# Altium project Smart Dimmer.PrjPcb
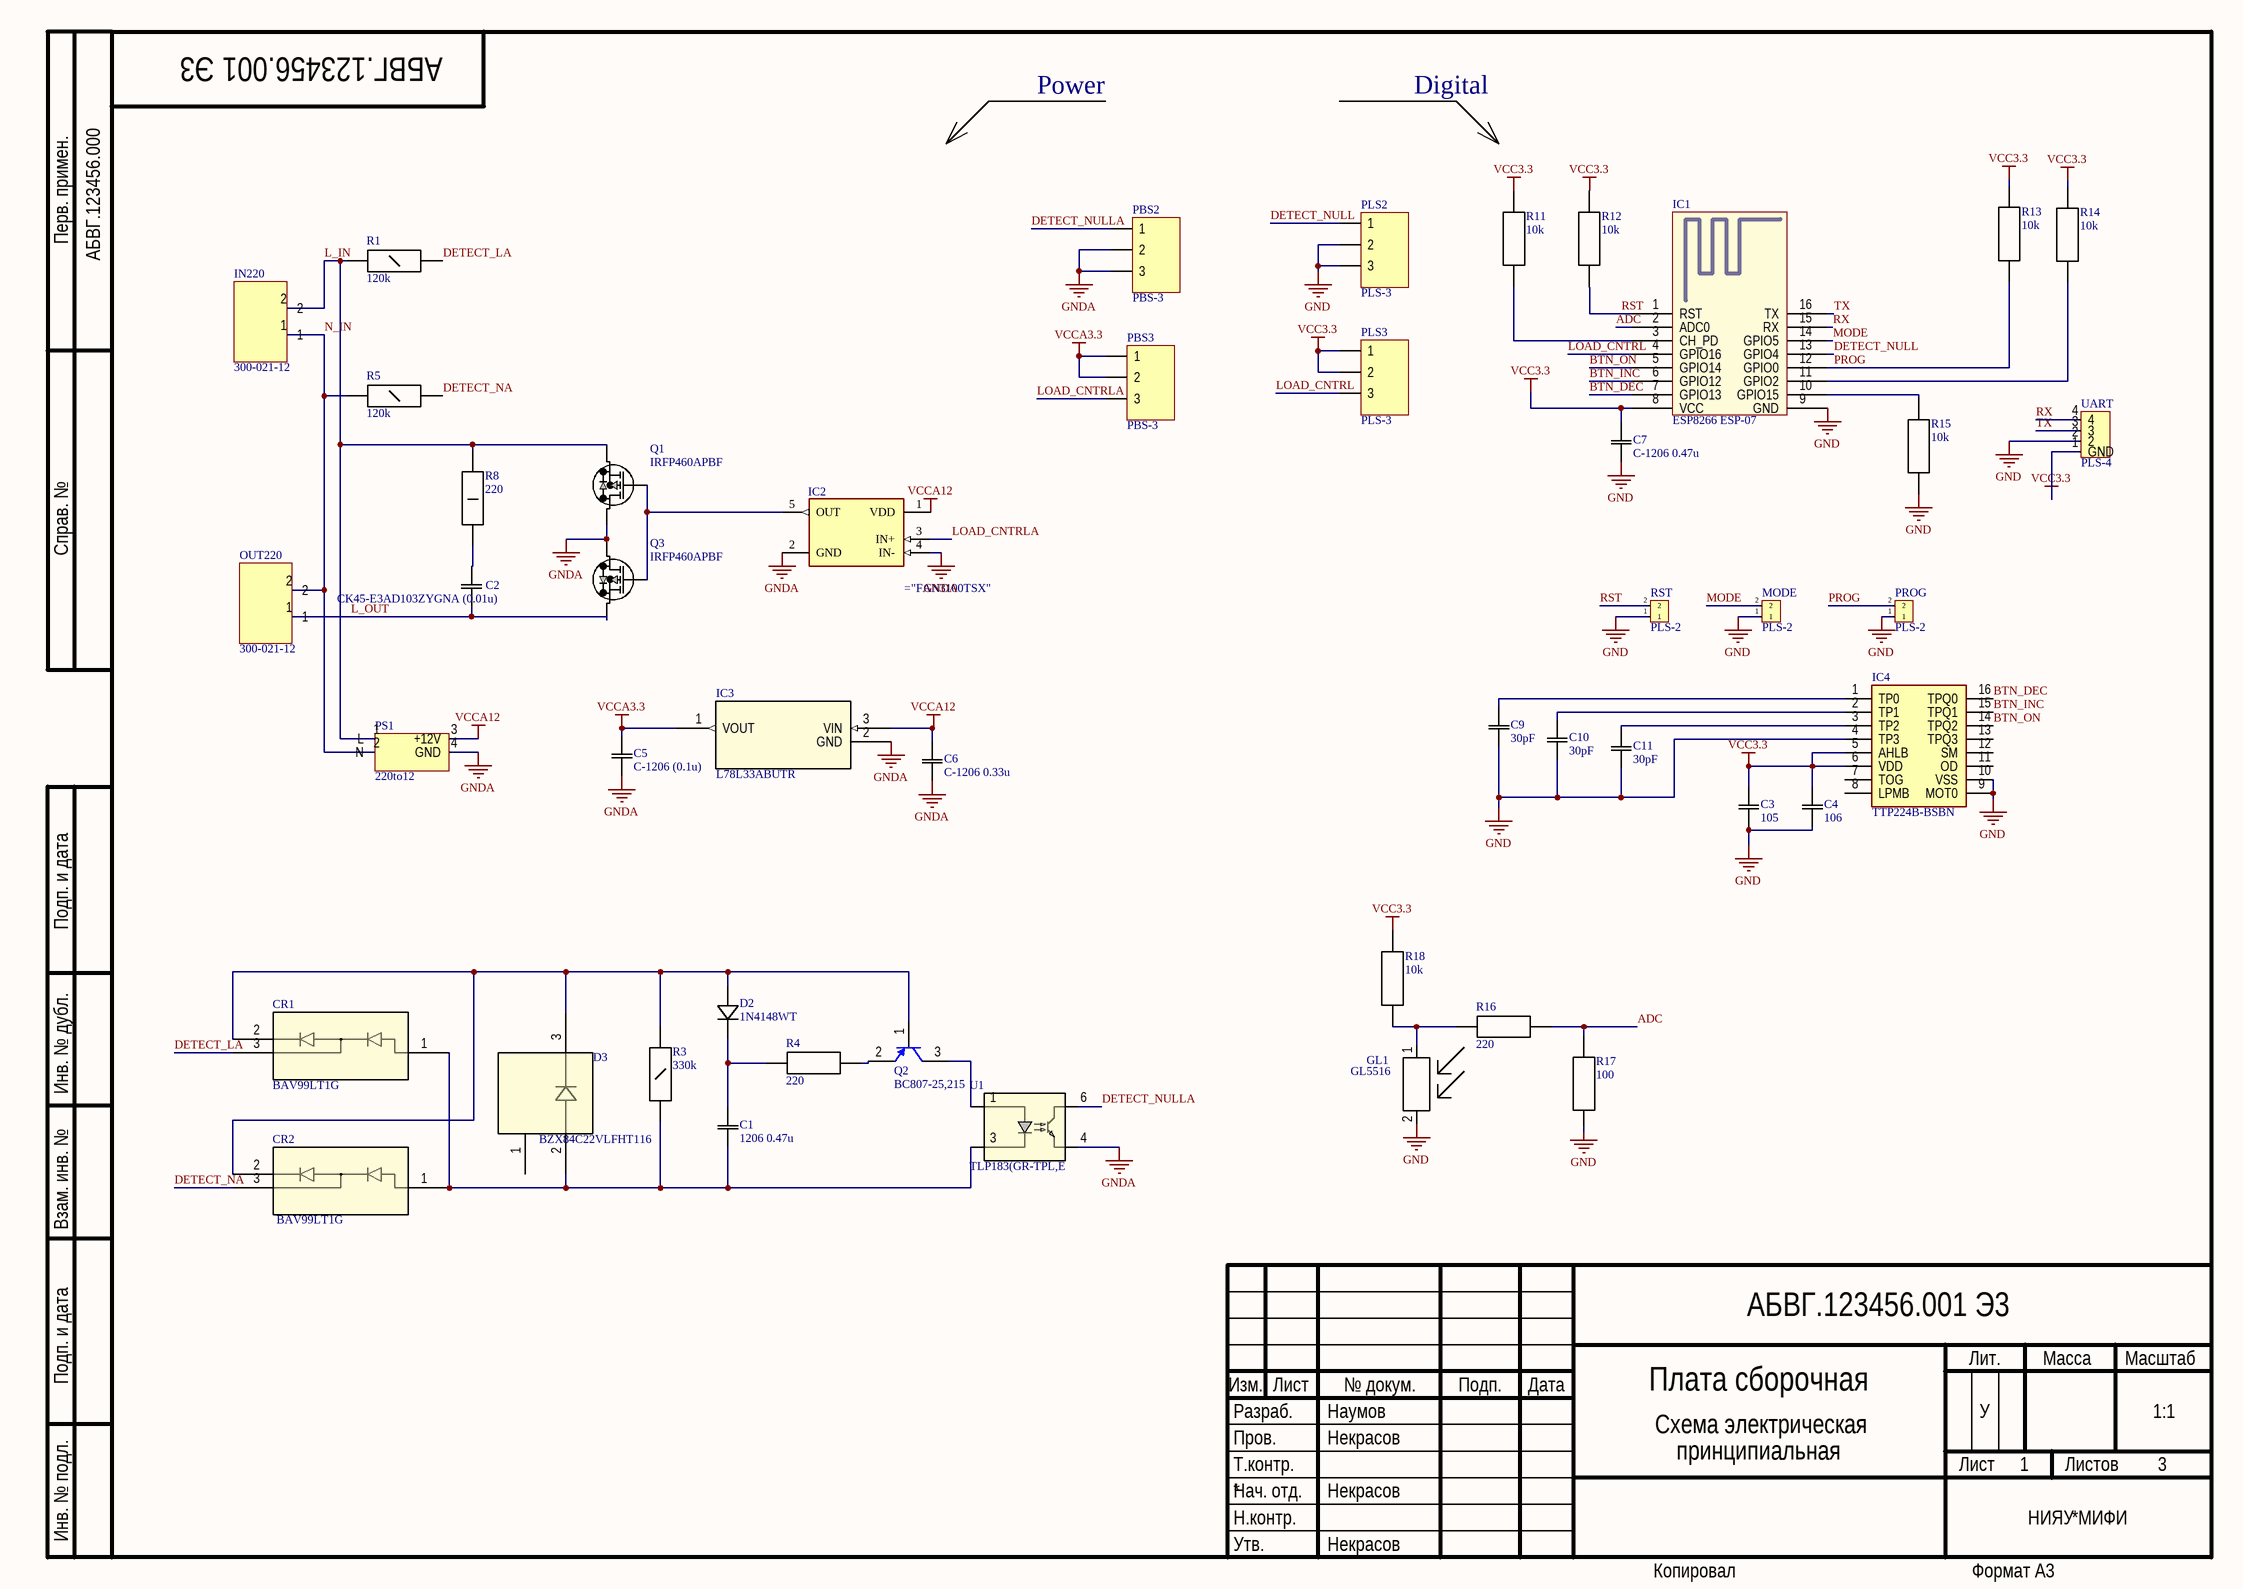
[diagram p0: dimmer.SchDoc]
3 sheets, 94 parts. Net scope: global (net labels, ports and power ports of the same name join across sheets).
Board files: PCB12_sensor.PcbDoc, PCB9.PcbDoc, PCB5.PcbDoc, PCB11_sensor.PcbDoc
Sheets:
  dimmer.SchDoc
  power.SchDoc
  digital.SchDoc

## Sheet dimmer.SchDoc
size 420 x 297 mm; SheetNumber: 1; SheetTotal: 3; Scale: 1:1; Разраб.: Наумов; Обозначение документа: АБВГ.123456.001 Э3; Пров.: Некрасов; Утв.: Некрасов; Номер листа: 1; Общее количество листов: 3; Масштаб: 1:1; Литера: У; Наименование организации: НИЯУ МИФИ; Перв. применение: АБВГ.123456.000; Наименование изделия 1: Плата сборочная; Наименование изделия 2: Схема электрическая; Наименование изделия 3: принципиальная; Нач. отд.: Нач. отд.; Фамилия нач. отд.: Некрасов

### Parts
(Parts that share a designator on the sheet are numbered #1, #2 ... from top to bottom, then left to right.)
C1#1  1206 0.47u  [CAP_X7R_1206_AVX]
C2#1  CK45-E3AD103ZYGNA (0.01u)  [CAP_CK45E3103_TDK]
C3#1  105  [G-21_MUR]
C4#1  106  [G-21_MUR]
C5#1  C-1206 (0.1u)  [CAP_X7R_1206_AVX]
C6#1  C-1206 0.33u  [CAP_X7R_1206_AVX]
C7#1  C-1206 0.47u  [CAP_X7R_1206_AVX]
C9#1  30pF  [G-21_MUR]
C10#1  30pF  [G-21_MUR]
C11#1  30pF  [G-21_MUR]
CR1#1  BAV99LT1G  [SOT-23_TO-236_318-08_ONS]
CR2#1  BAV99LT1G  [SOT-23_TO-236_318-08_ONS]
D2#1  1N4148WT  [CR_SOD-523F_ONS]
D3#1  BZX84C22VLFHT116  [TRANS_BZX84_ROM]
GL1#1  GL5516  [GL5516]
IC1#1  ESP8266 ESP-07  [ESP8266 ESP-07]
IC2#1  FAN3100TSX  [ON_Semi_527AH_0]  (value not drawn)
IC3#1  L78L33ABUTR  [SOT-89_STM]
IC4#1  TTP224B-BSBN  [SOP64P600X175-16N]
IN220#1  300-021-12  [300-021-12]
MODE#1  PLS-2  [PLS-2]
OUT220#1  300-021-12  [300-021-12]
PBS2#1  PBS-3  [PBS-3]
PBS3#1  PBS-3  [PBS-3]
PLS2#1  PLS-3  [PLS-3]
PLS3#1  PLS-3  [PLS-3]
PROG#1  PLS-2  [PLS-2]
PS1#1  220to12  [220to12]
Q1#1  IRFP460APBF  [TO-247AC_VIS]
Q2  BC807-25,215  [SOT23_BC807_NEX]
Q3#1  IRFP460APBF  [TO-247AC_VIS]
R1#1  120k  [CAP_X7R_1206_AVX]
R3#1  330k  [CAP_X7R_1206_AVX]
R4#1  220  [G-21_MUR]
R5#1  120k  [CAP_X7R_1206_AVX]
R8#1  220  [RES2512_TL_TYCO_TYC]
R11#1  10k  [G-21_MUR]
R12#1  10k  [G-21_MUR]
R13#1  10k  [G-21_MUR]
R14#1  10k  [G-21_MUR]
R15#1  10k  [G-21_MUR]
R16#1  220  [G-21_MUR]
R17#1  100  [G-21_MUR]
R18#1  10k  [G-21_MUR]
RST#1  PLS-2  [PLS-2]
U1#1  TLP183(GR-TPL,E  [4pin SO6_TOS]
UART#1  PLS-4  [PLS-4]

### Nets
GND: C3#1.1 C4#1.1 C7#1.1 C9#1.1 C10#1.1 C11#1.1 GL1#1.2 IC1#1.9(GND) IC4#1.4(TP3) IC4#1.9(MOT0) IC4#1.10(VSS) MODE#1.1 PLS2#1.2 PLS2#1.3 PROG#1.1 R15#1.1 R17#1.1 RST#1.1 UART#1.2
GNDA: C5#1.1 C6#1.1 IC2#1.2(GND) IC2#1.4(IN-) IC3#1.2(GND) PBS2#1.2 PBS2#1.3 PS1#1.4(GND) Q1#1.2(D) Q3#1.2(D) U1#1.4
VCC3.3: C3#1.2 C4#1.2 C7#1.2 IC1#1.8(VCC) IC4#1.5(AHLB) IC4#1.6(VDD) PLS3#1.1 PLS3#1.2 R11#1.2 R12#1.2 R13#1.2 R14#1.2 R18#1.2 UART#1.1(GND)
VCCA3.3: C5#1.2 IC3#1.1(VOUT) PBS3#1.1 PBS3#1.2
VCCA12: C6#1.2 IC2#1.1(VDD) IC3#1.3(VIN) PS1#1.3(+12V)
ADC: IC1#1.2(ADC0) R16#1.1 R17#1.2
BTN_DEC: IC1#1.7(GPIO13) IC4#1.16(TPQ0)
BTN_INC: IC1#1.6(GPIO12) IC4#1.15(TPQ1)
BTN_ON: IC1#1.5(GPIO14) IC4#1.14(TPQ2)
DETECT_LA: CR1#1.3 R1#1.2
DETECT_NA: CR2#1.3 R5#1.2
DETECT_NULL: IC1#1.13(GPIO4) PLS2#1.1
DETECT_NULLA: PBS2#1.1 U1#1.6
L_IN: IN220#1.2 PS1#1.1(L) Q1#1.3(S) R1#1.1 R8#1.2
L_OUT: C2#1.1 OUT220#1.1 Q3#1.3(S)
LOAD_CNTRL: IC1#1.4(GPIO16) PLS3#1.3
LOAD_CNTRLA: IC2#1.3(IN+) PBS3#1.3
MODE: IC1#1.14(GPIO5) MODE#1.2
N_IN: IN220#1.1 OUT220#1.2 PS1#1.2(N) R5#1.1
PROG: IC1#1.12(GPIO0) PROG#1.2 R13#1.1
RST: IC1#1.1(RST) R12#1.1 RST#1.2
RX: IC1#1.15(RX) UART#1.4
TX: IC1#1.16(TX) UART#1.3
NetC1#1_1: C1#1.1 CR1#1.1 CR2#1.1 D3#1.2 R3#1.1 U1#1.3
NetC1#1_2: C1#1.2 D2#1.1 R4#1.1
NetC2#1_2: C2#1.2 R8#1.1
NetC9#1_2: C9#1.2 IC4#1.1(TP0)
NetC10#1_2: C10#1.2 IC4#1.2(TP1)
NetC11#1_2: C11#1.2 IC4#1.3(TP2)
NetCR1#1_2: CR1#1.2 CR2#1.2 D2#1.2 D3#1.3 Q2.1(B) R3#1.2
NetGL1#1_1: GL1#1.1 R16#1.2 R18#1.1
NetIC1#1_3: IC1#1.3(CH_PD) R11#1.1
NetIC1#1_10: IC1#1.10(GPIO15) R15#1.2
NetIC1#1_11: IC1#1.11(GPIO2) R14#1.1
NetIC2#1_5: IC2#1.5(OUT) Q1#1.1(G) Q3#1.1(G)
NetQ2_2: Q2.2 R4#1.2
NetQ2_3: Q2.3(C) U1#1.1

Not connected (* = marked no-connect by the designer): D3#1 1(2); IC4#1 7(TOG) 8(LPMB) 11(OD) 12(SM) 13(TPQ3)

### Notes on the sheet
- Power
- Digital
- Перв. примен.
- Справ. №
- Подп. и дата
- Инв. № дубл.
- Взам. инв. №
- Разраб.
- Изм.
- Лист
- № докум.
- Подп.
- Дата
- Лит.
- Масса
- Масштаб
- Пров.
- Т.контр.
- Листов
- Инв. № подл.
- Утв.
- Н.контр.
- Копировал
- Формат А3

### Library data of the parts
C1#1 C5#1 C6#1 C7#1 = C-1206: No Description Available; Manufacturer_Part_Number: 12061C104KAT2A; Vendor: AVX Corporation; Built_By: EMA_UL_Team; SourceLibrary: AVX_2012-08-08; Type: DEV; Copyright: Copyright (C) 2018 Accelerated Designs. All rights reserved; RefDes: RefDes
C2#1 = CK45-E3AD103ZYGNA: No Description Available; Built_By: EMA_Matt; Vendor: TDK; SourceLibrary: TDK_2019-10-09; Type: DEV; Copyright: Copyright (C) 2018 Accelerated Designs. All rights reserved; Manufacturer_Part_Number: CK45-E3AD103ZYGNA; RefDes: RefDes
C3#1 C4#1 C9#1 C10#1 C11#1 = cap0805: Manufacturer_Part_Number: GRM21BR71H224KA01L; Vendor: Murata; SourceLibrary: Murata_2014-12-31; Type: DEV; Copyright: Copyright (C) 2015 Accelerated Designs. All rights reserved; RefDes: RefDes
CR1#1 CR2#1 = BAV99LT1G: No Description Available; Vendor: ON Semiconductor; Built_By: EMA_Cory; SourceLibrary: ON_Semiconductor_2020-05-27; Type: DEV; Datasheet: https://www.onsemi.com/pub/Collateral/BAV99LT1-D.PDF; Manufacturer_Part_Number: BAV99LT1G; Copyright: Copyright (C) 2018 Accelerated Designs. All rights reserved; RefDes: RefDes
D2#1 = 1N4148WT: No Description Available; Vendor: ON Semiconductor; Built_By: EMA_Cory; SourceLibrary: ON_Semiconductor_2020-03-23; Type: DEV; Datasheet: https://www.onsemi.com/pub/Collateral/1N914BWT-D.pdf; Manufacturer_Part_Number: 1N4148WT; Copyright: Copyright (C) 2018 Accelerated Designs. All rights reserved; RefDes: RefDes
D3#1 = BZX84C22VLFHT116: No Description Available; Vendor: ROHM Semiconductor; Built_By: EMA_Matt; SourceLibrary: Rohm_2019-09-23; Type: DEV; Manufacturer_Part_Number: BZX84C22VLFHT116; Copyright: Copyright (C) 2018 Accelerated Designs. All rights reserved; RefDes: RefDes
IC3#1 = L78L33ABUTR: No Description Available; SourceLibrary: StMicro_2011-06-07; Built_By: EMA_UL_Team; Vendor: STMicroelectronics; Manufacturer_Part_Number: L78L33ABUTR; Copyright: Copyright (C) 2018 Accelerated Designs. All rights reserved; RefDes: RefDes; Type: DEV
IC4#1 = TTP224B-BSBN: Integrated Circuit; Manufacturer_Name: TONTEK; Datasheet Link: https://datasheet.lcsc.com/szlcsc/Tontek-Design-Tech-TTP224B-BSBN_C94149.pdf; Height: 1.75mm; Manufacturer_Part_Number: TTP224B-BSBN
Q1#1 Q3#1 = IRFP460APBF: No Description Available; Vendor: Vishay; Built_By: EMA_UL_Team; SourceLibrary: Vishay_2020-02-10; Type: DEV; Manufacturer_Part_Number: IRFP460APBF; Copyright: Copyright (C) 2018 Accelerated Designs. All rights reserved; RefDes: RefDes
Q2 = BC807-25,215: No Description Available; Built_By: EMA_Justin; Vendor: Nexperia; SourceLibrary: Nexperia_2018-12-15; Type: DEV; Copyright: Copyright (C) 2016 Accelerated Designs. All rights reserved; Manufacturer_Part_Number: BC807-25,215; RefDes: RefDes
R1#1 R3#1 R5#1 = R-1206
R4#1 R11#1 R12#1 R13#1 R14#1 R15#1 R16#1 R17#1 R18#1 = res0805: Resistor 0805
R8#1 = R-2512: No Description Available; Manufacturer_Part_Number: TL3AR033F; Vendor: TE Connectivity; Built_By: EMA_UL_Team; SourceLibrary: Tyco_2012-01-31a; Copyright: Copyright (C) 2018 Accelerated Designs. All rights reserved; RefDes: RefDes; Type: DEV
U1#1 = TLP183(GR-TPL,E: No Description Available; Vendor: Toshiba; Built_By: EMA_UL_Team; SourceLibrary: Toshiba_2019-12-10; Number_devices_in_Package: 1; Manufacturer_Part_Number: TLP183(GR-TPL,E; Copyright: Copyright (C) 2018 Accelerated Designs. All rights reserved; RefDes: RefDes; Type: DEV; Source_Package: TLP183

## Sheet power.SchDoc
size 209 x 297 mm; Scale: 1:1; Обозначение документа: АБВГ.123456.001 Э3; Номер листа: 2; Разраб.: Наумов; Пров.: Некрасов; Утв.: Некрасов; Масштаб: 1:1; Литера: У; Наименование организации: НИЯУ МИФИ; Перв. применение: АБВГ.123456.000; Наименование изделия 1: Плата силовая; Наименование изделия 2: Схема электрическая; Наименование изделия 3: принципиальная; Нач. отд.: Нач. отд.
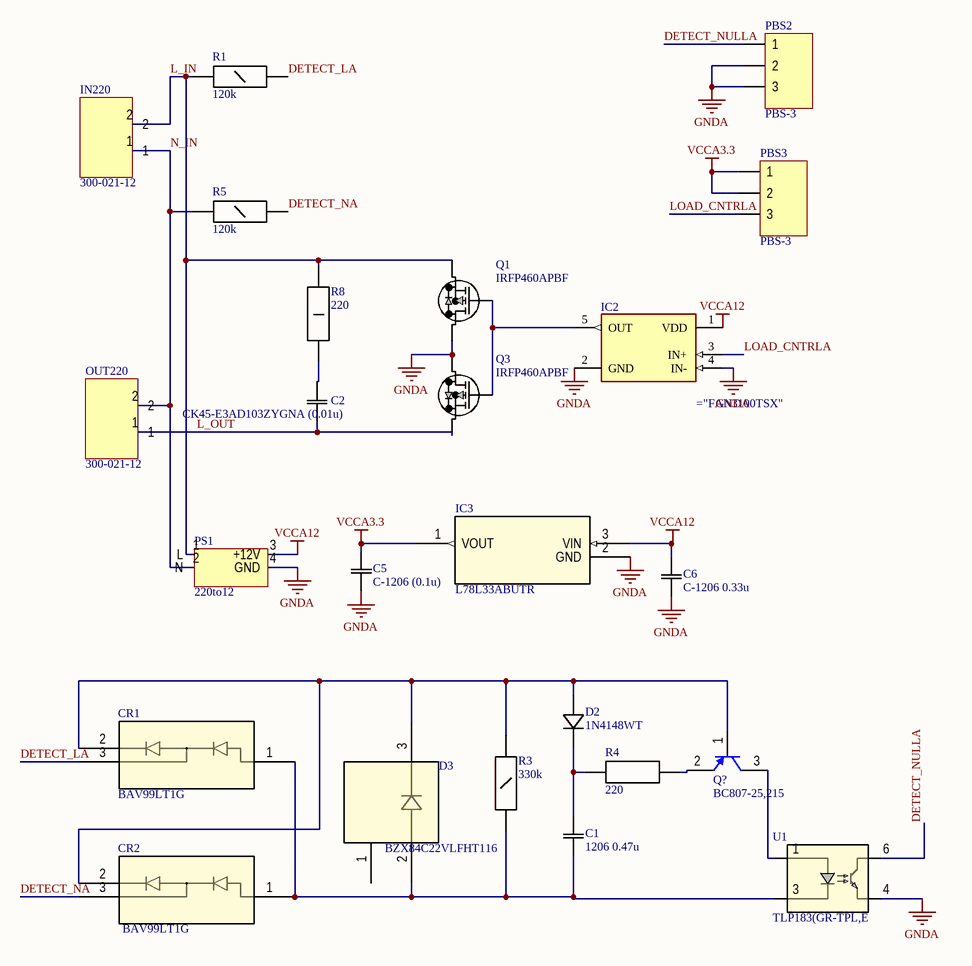
[diagram p1: power.SchDoc]

### Parts
(Parts that share a designator on the sheet are numbered #1, #2 ... from top to bottom, then left to right.)
C1#2  1206 0.47u  [CAP_X7R_1206_AVX]
C2#2  CK45-E3AD103ZYGNA (0.01u)  [CAP_CK45E3103_TDK]
C5#2  C-1206 (0.1u)  [CAP_X7R_1206_AVX]
C6#2  C-1206 0.33u  [CAP_X7R_1206_AVX]
CR1#2  BAV99LT1G  [SOT-23_TO-236_318-08_ONS]
CR2#2  BAV99LT1G  [SOT-23_TO-236_318-08_ONS]
D2#2  1N4148WT  [CR_SOD-523F_ONS]
D3#2  BZX84C22VLFHT116  [TRANS_BZX84_ROM]
IC2#2  FAN3100TSX  [ON_Semi_527AH_0]  (value not drawn)
IC3#2  L78L33ABUTR  [SOT-89_STM]
IN220#2  300-021-12  [300-021-12]
OUT220#2  300-021-12  [300-021-12]
PBS2#2  PBS-3  [PBS-3]
PBS3#2  PBS-3  [PBS-3]
PS1#2  220to12  [220to12]
Q1#2  IRFP460APBF  [TO-247AC_VIS]
Q3#2  IRFP460APBF  [TO-247AC_VIS]
Q?  BC807-25,215  [SOT23_BC807_NEX]
R1#2  120k  [CAP_X7R_1206_AVX]
R3#2  330k  [CAP_X7R_1206_AVX]
R4#2  220  [G-21_MUR]
R5#2  120k  [CAP_X7R_1206_AVX]
R8#2  220  [RES2512_TL_TYCO_TYC]
U1#2  TLP183(GR-TPL,E  [4pin SO6_TOS]

### Nets
GNDA: C5#2.1 C6#2.1 IC2#2.2(GND) IC2#2.4(IN-) IC3#2.2(GND) PBS2#2.2 PBS2#2.3 PS1#2.4(GND) Q1#2.2(D) Q3#2.2(D) U1#2.4
VCCA3.3: C5#2.2 IC3#2.1(VOUT) PBS3#2.1 PBS3#2.2
VCCA12: C6#2.2 IC2#2.1(VDD) IC3#2.3(VIN) PS1#2.3(+12V)
DETECT_LA: CR1#2.3 R1#2.2
DETECT_NA: CR2#2.3 R5#2.2
DETECT_NULLA: PBS2#2.1 U1#2.6
L_IN: IN220#2.2 PS1#2.1(L) Q1#2.3(S) R1#2.1 R8#2.2
L_OUT: C2#2.1 OUT220#2.1 Q3#2.3(S)
LOAD_CNTRLA: IC2#2.3(IN+) PBS3#2.3
N_IN: IN220#2.1 OUT220#2.2 PS1#2.2(N) R5#2.1
NetC1#2_1: C1#2.1 CR1#2.1 CR2#2.1 D3#2.2 R3#2.1 U1#2.3
NetC1#2_2: C1#2.2 D2#2.1 R4#2.1
NetC2#2_2: C2#2.2 R8#2.1
NetCR1#2_2: CR1#2.2 CR2#2.2 D2#2.2 D3#2.3 Q?.1(B) R3#2.2
NetIC2#2_5: IC2#2.5(OUT) Q1#2.1(G) Q3#2.1(G)
NetQ?_2: Q?.2 R4#2.2
NetQ?_3: Q?.3(C) U1#2.1

Not connected (* = marked no-connect by the designer): D3#2 1(2)

### Notes on the sheet
- Перв. примен.
- Справ. №
- Подп. и дата
- Инв. № дубл.
- Взам. инв. №
- Разраб.
- Изм.
- Лист
- № докум.
- Подп.
- Дата
- Лит.
- Масса
- Масштаб
- Пров.
- Т.контр.
- Листов
- Инв. № подл.
- Утв.
- Н.контр.
- Копировал
- Формат А4

### Library data of the parts
C1#2 C5#2 C6#2 = C-1206: as C1#1 on sheet dimmer; Copyright: Copyright (C) 2018 Accelerated Designs. All rights reserved; RefDes: RefDes
C2#2 = CK45-E3AD103ZYGNA: as C2#1 on sheet dimmer; Copyright: Copyright (C) 2018 Accelerated Designs. All rights reserved; Manufacturer_Part_Number: CK45-E3AD103ZYGNA; RefDes: RefDes
CR1#2 CR2#2 = BAV99LT1G: as CR1#1 on sheet dimmer; Datasheet: https://www.onsemi.com/pub/Collateral/BAV99LT1-D.PDF; Manufacturer_Part_Number: BAV99LT1G; Copyright: Copyright (C) 2018 Accelerated Designs. All rights reserved; RefDes: RefDes
D2#2 = 1N4148WT: as D2#1 on sheet dimmer; Datasheet: https://www.onsemi.com/pub/Collateral/1N914BWT-D.pdf; Manufacturer_Part_Number: 1N4148WT; Copyright: Copyright (C) 2018 Accelerated Designs. All rights reserved; RefDes: RefDes
D3#2 = BZX84C22VLFHT116: as D3#1 on sheet dimmer; Manufacturer_Part_Number: BZX84C22VLFHT116; Copyright: Copyright (C) 2018 Accelerated Designs. All rights reserved; RefDes: RefDes
IC3#2 = L78L33ABUTR: as IC3#1 on sheet dimmer; Manufacturer_Part_Number: L78L33ABUTR; Copyright: Copyright (C) 2018 Accelerated Designs. All rights reserved; RefDes: RefDes; Type: DEV
Q1#2 Q3#2 = IRFP460APBF: as Q1#1 on sheet dimmer; Manufacturer_Part_Number: IRFP460APBF; Copyright: Copyright (C) 2018 Accelerated Designs. All rights reserved; RefDes: RefDes
Q? = BC807-25,215: as Q2 on sheet dimmer; Copyright: Copyright (C) 2016 Accelerated Designs. All rights reserved; Manufacturer_Part_Number: BC807-25,215; RefDes: RefDes
R1#2 R3#2 R5#2 = R-1206
R4#2 = res0805: Resistor 0805
R8#2 = R-2512: as R8#1 on sheet dimmer; Copyright: Copyright (C) 2018 Accelerated Designs. All rights reserved; RefDes: RefDes; Type: DEV
U1#2 = TLP183(GR-TPL,E: as U1#1 on sheet dimmer; Manufacturer_Part_Number: TLP183(GR-TPL,E; Copyright: Copyright (C) 2018 Accelerated Designs. All rights reserved; RefDes: RefDes; Type: DEV; Source_Package: TLP183

## Sheet digital.SchDoc
size 209 x 297 mm; Scale: 1:1; Разраб.: Наумов; Обозначение документа: АБВГ.123456.001 Э3; Пров.: Некрасов; Утв.: Некрасов; Номер листа: 3; Общее количество листов: 3; Масштаб: 1:1; Литера: У; Наименование организации: НИЯУ МИФИ; Перв. применение: АБВГ.123456.000; Наименование изделия 1: Плата цифровая; Наименование изделия 2: Схема электрическая; Наименование изделия 3: принципиальная; Нач. отд.: Нач. отд.
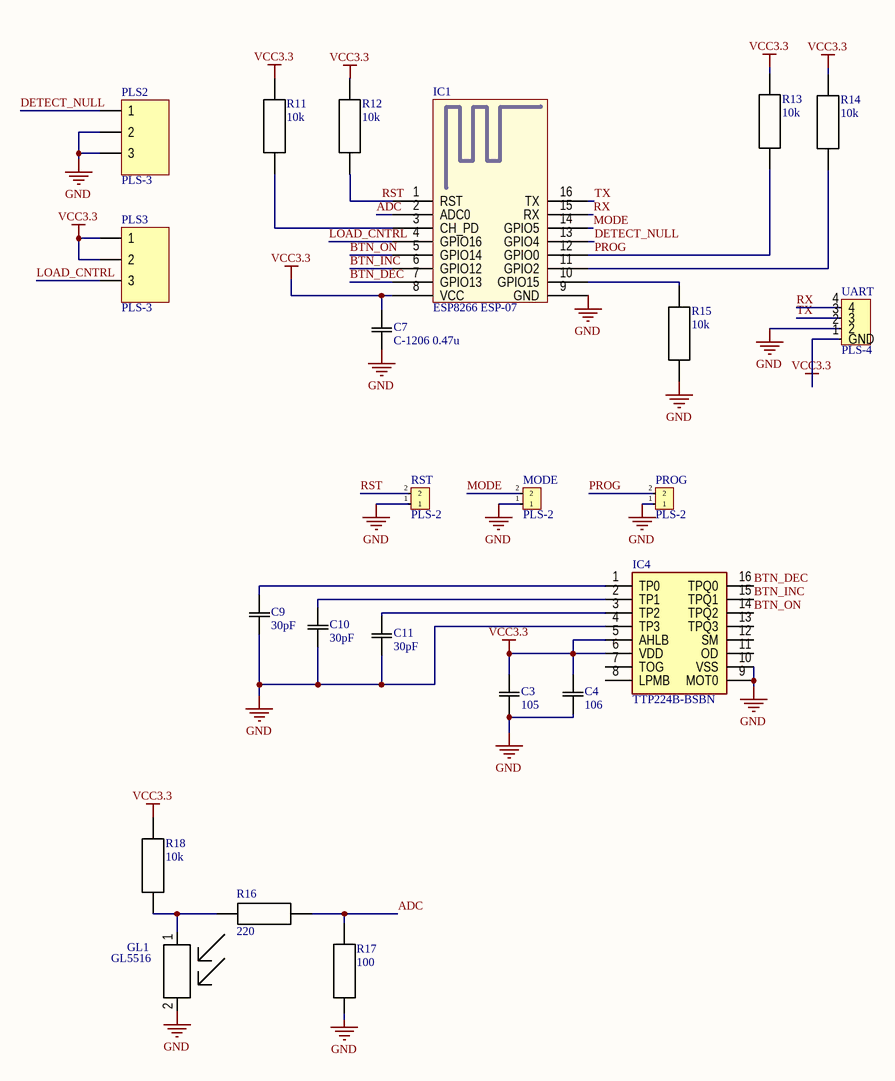
[diagram p2: digital.SchDoc]

### Parts
(Parts that share a designator on the sheet are numbered #1, #2 ... from top to bottom, then left to right.)
C3#2  105  [G-21_MUR]
C4#2  106  [G-21_MUR]
C7#2  C-1206 0.47u  [CAP_X7R_1206_AVX]
C9#2  30pF  [G-21_MUR]
C10#2  30pF  [G-21_MUR]
C11#2  30pF  [G-21_MUR]
GL1#2  GL5516  [GL5516]
IC1#2  ESP8266 ESP-07  [ESP8266 ESP-07]
IC4#2  TTP224B-BSBN  [SOP64P600X175-16N]
MODE#2  PLS-2  [PLS-2]
PLS2#2  PLS-3  [PLS-3]
PLS3#2  PLS-3  [PLS-3]
PROG#2  PLS-2  [PLS-2]
R11#2  10k  [G-21_MUR]
R12#2  10k  [G-21_MUR]
R13#2  10k  [G-21_MUR]
R14#2  10k  [G-21_MUR]
R15#2  10k  [G-21_MUR]
R16#2  220  [G-21_MUR]
R17#2  100  [G-21_MUR]
R18#2  10k  [G-21_MUR]
RST#2  PLS-2  [PLS-2]
UART#2  PLS-4  [PLS-4]

### Nets
GND: C3#2.1 C4#2.1 C7#2.1 C9#2.1 C10#2.1 C11#2.1 GL1#2.2 IC1#2.9(GND) IC4#2.4(TP3) IC4#2.9(MOT0) IC4#2.10(VSS) MODE#2.1 PLS2#2.2 PLS2#2.3 PROG#2.1 R15#2.1 R17#2.1 RST#2.1 UART#2.2
VCC3.3: C3#2.2 C4#2.2 C7#2.2 IC1#2.8(VCC) IC4#2.5(AHLB) IC4#2.6(VDD) PLS3#2.1 PLS3#2.2 R11#2.2 R12#2.2 R13#2.2 R14#2.2 R18#2.2 UART#2.1(GND)
ADC: IC1#2.2(ADC0) R16#2.1 R17#2.2
BTN_DEC: IC1#2.7(GPIO13) IC4#2.16(TPQ0)
BTN_INC: IC1#2.6(GPIO12) IC4#2.15(TPQ1)
BTN_ON: IC1#2.5(GPIO14) IC4#2.14(TPQ2)
DETECT_NULL: IC1#2.13(GPIO4) PLS2#2.1
LOAD_CNTRL: IC1#2.4(GPIO16) PLS3#2.3
MODE: IC1#2.14(GPIO5) MODE#2.2
PROG: IC1#2.12(GPIO0) PROG#2.2 R13#2.1
RST: IC1#2.1(RST) R12#2.1 RST#2.2
RX: IC1#2.15(RX) UART#2.4
TX: IC1#2.16(TX) UART#2.3
NetC9#2_2: C9#2.2 IC4#2.1(TP0)
NetC10#2_2: C10#2.2 IC4#2.2(TP1)
NetC11#2_2: C11#2.2 IC4#2.3(TP2)
NetGL1#2_1: GL1#2.1 R16#2.2 R18#2.1
NetIC1#2_3: IC1#2.3(CH_PD) R11#2.1
NetIC1#2_10: IC1#2.10(GPIO15) R15#2.2
NetIC1#2_11: IC1#2.11(GPIO2) R14#2.1

Not connected (* = marked no-connect by the designer): IC4#2 7(TOG) 8(LPMB) 11(OD) 12(SM) 13(TPQ3)

### Notes on the sheet
- Перв. примен.
- Справ. №
- Подп. и дата
- Инв. № дубл.
- Взам. инв. №
- Разраб.
- Изм.
- Лист
- № докум.
- Подп.
- Дата
- Лит.
- Масса
- Масштаб
- Пров.
- Т.контр.
- Листов
- Инв. № подл.
- Утв.
- Н.контр.
- Копировал
- Формат А4

### Library data of the parts
C3#2 C4#2 C9#2 C10#2 C11#2 = cap0805: as C3#1 on sheet dimmer; Copyright: Copyright (C) 2015 Accelerated Designs. All rights reserved; RefDes: RefDes
C7#2 = C-1206: as C1#1 on sheet dimmer; Copyright: Copyright (C) 2018 Accelerated Designs. All rights reserved; RefDes: RefDes
IC4#2 = TTP224B-BSBN: as IC4#1 on sheet dimmer; Datasheet Link: https://datasheet.lcsc.com/szlcsc/Tontek-Design-Tech-TTP224B-BSBN_C94149.pdf; Height: 1.75mm; Manufacturer_Part_Number: TTP224B-BSBN
R11#2 R12#2 R13#2 R14#2 R15#2 R16#2 R17#2 R18#2 = res0805: Resistor 0805

## Nets that join several sheets
GND: dimmer (19 pins), digital (19 pins)
GNDA: dimmer (11 pins), power (11 pins)
VCC3.3: dimmer (14 pins), digital (14 pins)
VCCA3.3: dimmer (C5#1.2 IC3#1.1 PBS3#1.1 PBS3#1.2), power (C5#2.2 IC3#2.1 PBS3#2.1 PBS3#2.2)
VCCA12: dimmer (C6#1.2 IC2#1.1 IC3#1.3 PS1#1.3), power (C6#2.2 IC2#2.1 IC3#2.3 PS1#2.3)
ADC: dimmer (IC1#1.2 R16#1.1 R17#1.2), digital (IC1#2.2 R16#2.1 R17#2.2)
BTN_DEC: dimmer (IC1#1.7 IC4#1.16), digital (IC1#2.7 IC4#2.16)
BTN_INC: dimmer (IC1#1.6 IC4#1.15), digital (IC1#2.6 IC4#2.15)
BTN_ON: dimmer (IC1#1.5 IC4#1.14), digital (IC1#2.5 IC4#2.14)
DETECT_LA: dimmer (CR1#1.3 R1#1.2), power (CR1#2.3 R1#2.2)
DETECT_NA: dimmer (CR2#1.3 R5#1.2), power (CR2#2.3 R5#2.2)
DETECT_NULL: dimmer (IC1#1.13 PLS2#1.1), digital (IC1#2.13 PLS2#2.1)
DETECT_NULLA: dimmer (PBS2#1.1 U1#1.6), power (PBS2#2.1 U1#2.6)
L_IN: dimmer (5 pins), power (5 pins)
L_OUT: dimmer (C2#1.1 OUT220#1.1 Q3#1.3), power (C2#2.1 OUT220#2.1 Q3#2.3)
LOAD_CNTRL: dimmer (IC1#1.4 PLS3#1.3), digital (IC1#2.4 PLS3#2.3)
LOAD_CNTRLA: dimmer (IC2#1.3 PBS3#1.3), power (IC2#2.3 PBS3#2.3)
MODE: dimmer (IC1#1.14 MODE#1.2), digital (IC1#2.14 MODE#2.2)
N_IN: dimmer (IN220#1.1 OUT220#1.2 PS1#1.2 R5#1.1), power (IN220#2.1 OUT220#2.2 PS1#2.2 R5#2.1)
PROG: dimmer (IC1#1.12 PROG#1.2 R13#1.1), digital (IC1#2.12 PROG#2.2 R13#2.1)
RST: dimmer (IC1#1.1 R12#1.1 RST#1.2), digital (IC1#2.1 R12#2.1 RST#2.2)
RX: dimmer (IC1#1.15 UART#1.4), digital (IC1#2.15 UART#2.4)
TX: dimmer (IC1#1.16 UART#1.3), digital (IC1#2.16 UART#2.3)